# Altium schematic sheet DCDC_Converter.SchDoc
size A4; SheetNumber: 4; SheetTotal: 5
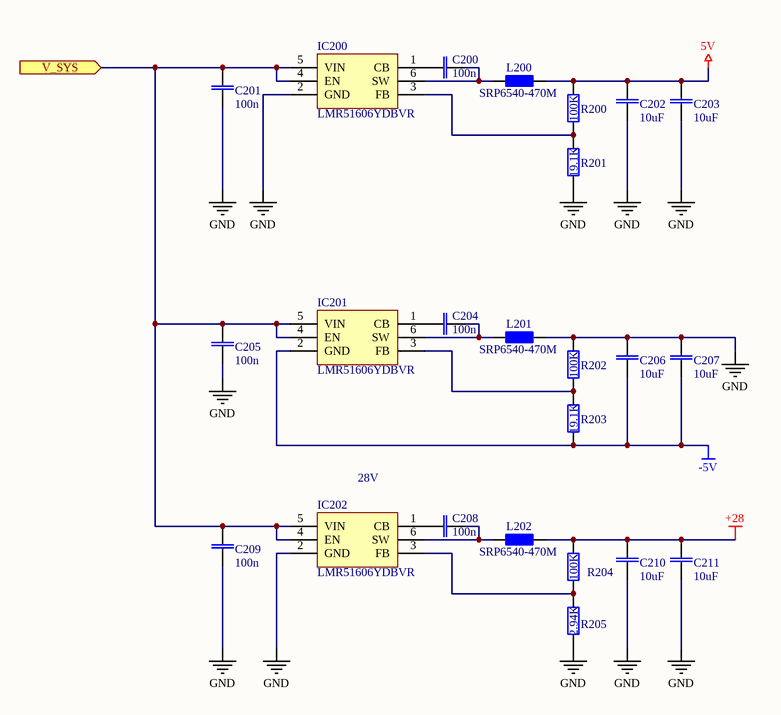
[diagram p0: DCDC_Converter.SchDoc]

## Parts
C200  100n  [CAP0402]
C201  100n  [CAP0402]
C202  10uF  [CAP0402]
C203  10uF  [CAP0402]
C204  100n  [CAP0402]
C205  100n  [CAP0402]
C206  10uF  [CAP0402]
C207  10uF  [CAP0402]
C208  100n  [CAP0402]
C209  100n  [CAP0402]
C210  10uF  [CAP0603]
C211  10uF  [CAP0603]
IC200  LMR51606YDBVR  [SOT95P245X120-6N]
IC201  LMR51606YDBVR  [SOT95P245X120-6N]
IC202  LMR51606YDBVR  [SOT95P245X120-6N]
L200  SRP6540-470M  [SRP6540]
L201  SRP6540-470M  [SRP6540]
L202  SRP6540-470M  [SRP6540]
R200  RC0402FR-07100KL  [RES0402]  (value not drawn)
R201  RC0402FR-0719K1L  [RES0402]  (value not drawn)
R202  RC0402FR-07100KL  [RES0402]  (value not drawn)
R203  RC0402FR-0719K1L  [RES0402]  (value not drawn)
R204  RC0402FR-07100KL  [RES0402]  (value not drawn)
R205  RC0402FR-072K94L  [RES0402]  (value not drawn)

## Ports
V_SYS (in, see Overview[2A], OutputStage[2A])

## Nets
5V: C202.2 C203.2 L200.2 R200.2
+28: C210.2 C211.2 L202.2 R204.2
-5V: C206.1 C207.1 IC201.2(GND) R203.1
GND: C201.2 C202.1 C203.1 C205.2 C206.2 C207.2 C209.2 C210.1 C211.1 IC200.2(GND) IC202.2(GND) L201.2 R201.1 R202.2 R205.1
V_SYS: C201.1 C205.1 C209.1 IC200.4(EN) IC200.5(VIN) IC201.4(EN) IC201.5(VIN) IC202.4(EN) IC202.5(VIN) ; port V_SYS
NetC200_1: C200.1 IC200.6(SW) L200.1
NetC200_2: C200.2 IC200.1(CB)
NetC204_1: C204.1 IC201.6(SW) L201.1
NetC204_2: C204.2 IC201.1(CB)
NetC208_1: C208.1 IC202.6(SW) L202.1
NetC208_2: C208.2 IC202.1(CB)
NetIC200_3: IC200.3(FB) R200.1 R201.2
NetIC201_3: IC201.3(FB) R202.1 R203.2
NetIC202_3: IC202.3(FB) R204.1 R205.2

## Notes on the sheet
- (near IC202) 28V

## Library data of the parts
C200 C201 C204 C205 C208 C209 = CL05A104KA5NNNC: MaxVoltage: 25V; Dialectric: X5R; Tolerance: 10%; Value: 100n; MPN: CL05A104KA5NNNC
C202 C203 C206 C207 = GRM155R61A106ME11D: MPN: CC0402KRX7R9BB222; MaxVoltage: 50V; Value: 10uF
C210 C211 = GRM188R6YA106MA73D: MPN: CL05A475MP5NRNC; MaxVoltage: 10V; Dialectric: X5R; Tolerance: 20%; Value: 10uF
R200 R202 R204 = RC0402FR-07100KL: Value: 100K; MPN: RC0402FR-07100KL
R201 R203 = RC0402FR-0719K1L: Value: 19.1K; MPN: RC0402FR-0719K1L
R205 = RC0402FR-072K94L: Value: 2.94K; MPN: RC0402FR-072K94L
IC200-IC202 = LMR51606YDBVR: MPN: LMR51606YDBVR
L200-L202 = SRP6540-470M: MPN: SRP6540-470M